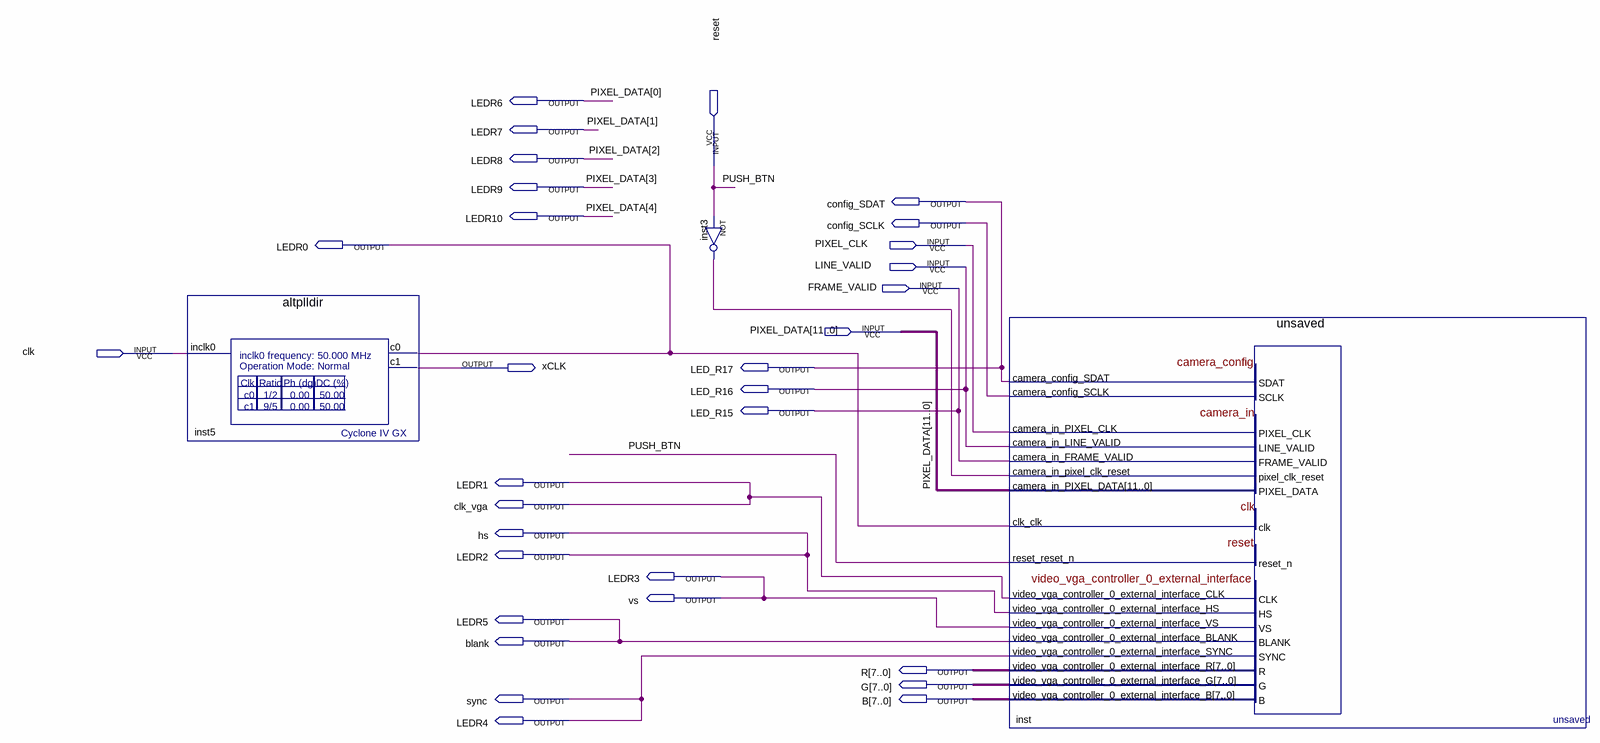
[diagram p0: schematic sheet]
// Quartus schematic teste.bdf as structural Verilog: 3 symbols, 31 pins
module teste (
  input  reset,
  input  PIXEL_CLK,
  input  LINE_VALID,
  input  FRAME_VALID,
  input  [11:0] PIXEL_DATA,
  input  clk,
  output LEDR6,
  output LEDR7,
  output LEDR8,
  output LEDR9,
  output config_SDAT,
  output LEDR10,
  output config_SCLK,
  output LEDR0,
  output xCLK,
  output LED_R17,
  output LED_R16,
  output LED_R15,
  output LEDR1,
  output clk_vga,
  output hs,
  output LEDR2,
  output LEDR3,
  output vs,
  output LEDR5,
  output blank,
  output [7:0] R,
  output [7:0] G,
  output sync,
  output [7:0] B,
  output LEDR4
);

  wire inst3_out;

  altplldir inst5 (.inclk0(clk), .c0(LEDR0), .c1(xCLK));
  not inst3 (inst3_out, reset);
  unsaved inst (
    .camera_in_PIXEL_CLK(PIXEL_CLK), .camera_in_LINE_VALID(LINE_VALID), .camera_in_FRAME_VALID(FRAME_VALID),
    .camera_in_pixel_clk_reset(inst3_out), .camera_in_PIXEL_DATA(PIXEL_DATA), .clk_clk(LEDR0),
    .reset_reset_n(reset), .camera_config_SCLK(config_SCLK),
    .video_vga_controller_0_external_interface_CLK(clk_vga),
    .video_vga_controller_0_external_interface_HS(hs), .video_vga_controller_0_external_interface_VS(LEDR3),
    .video_vga_controller_0_external_interface_BLANK(blank),
    .video_vga_controller_0_external_interface_SYNC(LEDR4), .video_vga_controller_0_external_interface_R(R),
    .video_vga_controller_0_external_interface_G(G), .video_vga_controller_0_external_interface_B(B),
    .camera_config_SDAT(config_SDAT));

  assign LED_R15 = FRAME_VALID;
  assign LED_R16 = LINE_VALID;
  assign LED_R17 = config_SDAT;
  assign LEDR1 = clk_vga;
  assign LEDR2 = hs;
  assign LEDR5 = blank;
  assign LEDR6 = PIXEL_DATA[0];
  assign LEDR7 = PIXEL_DATA[1];
  assign LEDR8 = PIXEL_DATA[2];
  assign LEDR9 = PIXEL_DATA[3];
  assign LEDR10 = PIXEL_DATA[4];
  assign sync = LEDR4;
  assign vs = LEDR3;

  // Other names for the same wires on the sheet: PUSH_BTN = reset
endmodule
